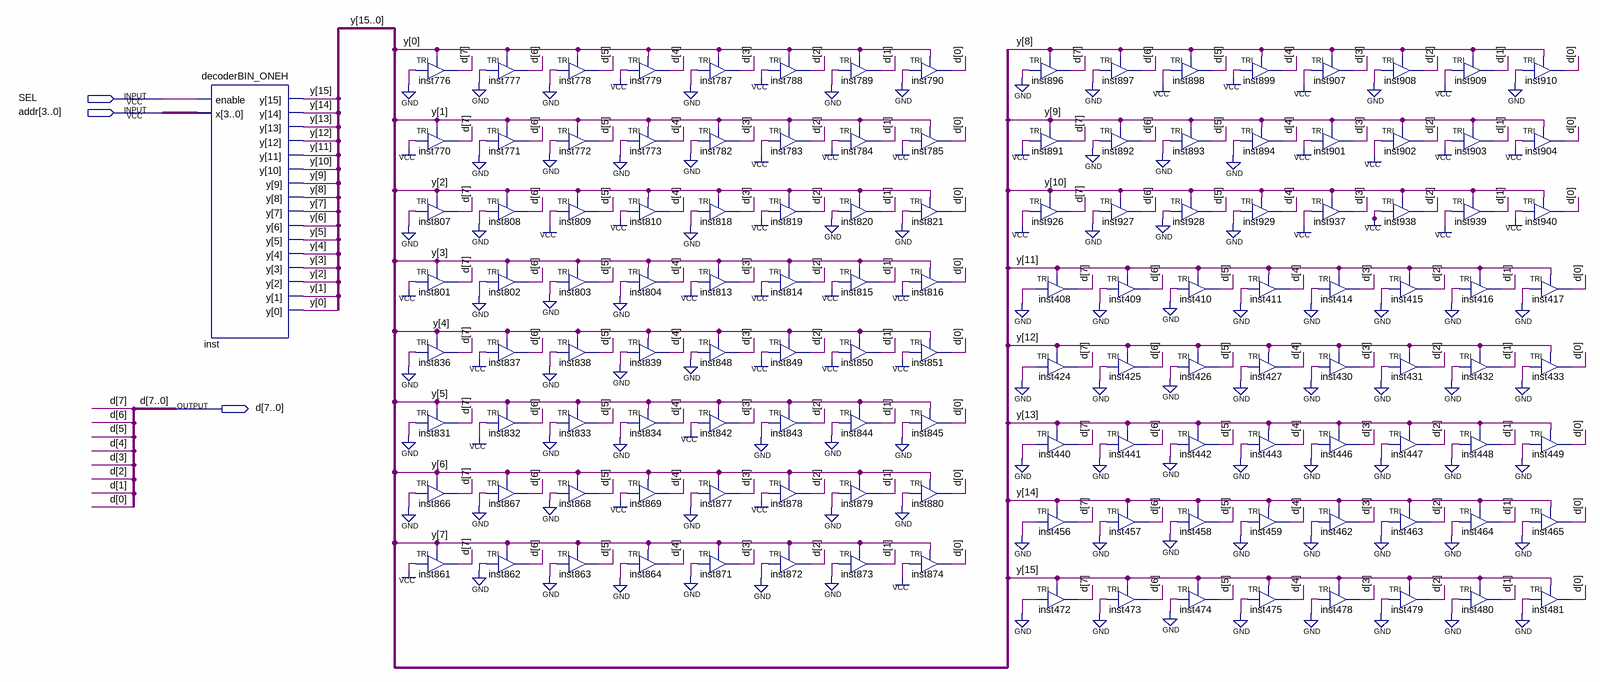
[diagram p0: schematic sheet]
// Quartus schematic rom16x8_23.bdf as structural Verilog: 129 symbols, 3 pins
module rom16x8_23 (
  input  SEL,
  input  [3:0] addr,
  output [7:0] d
);

  wire [15:0] y;

  decoderBIN_ONEH inst (.enable(SEL), .x(addr), .y(y));
  TRI inst776 (.IN(1'b0), .OE(y[0]), .OUT(d[7]));
  TRI inst770 (.IN(1'b1), .OE(y[1]), .OUT(d[7]));
  TRI inst807 (.IN(1'b0), .OE(y[2]), .OUT(d[7]));
  TRI inst801 (.IN(1'b1), .OE(y[3]), .OUT(d[7]));
  TRI inst836 (.IN(1'b0), .OE(y[4]), .OUT(d[7]));
  TRI inst831 (.IN(1'b0), .OE(y[5]), .OUT(d[7]));
  TRI inst866 (.IN(1'b0), .OE(y[6]), .OUT(d[7]));
  TRI inst861 (.IN(1'b1), .OE(y[7]), .OUT(d[7]));
  TRI inst777 (.IN(1'b0), .OE(y[0]), .OUT(d[6]));
  TRI inst771 (.IN(1'b0), .OE(y[1]), .OUT(d[6]));
  TRI inst808 (.IN(1'b0), .OE(y[2]), .OUT(d[6]));
  TRI inst802 (.IN(1'b0), .OE(y[3]), .OUT(d[6]));
  TRI inst837 (.IN(1'b1), .OE(y[4]), .OUT(d[6]));
  TRI inst832 (.IN(1'b1), .OE(y[5]), .OUT(d[6]));
  TRI inst867 (.IN(1'b0), .OE(y[6]), .OUT(d[6]));
  TRI inst862 (.IN(1'b0), .OE(y[7]), .OUT(d[6]));
  TRI inst778 (.IN(1'b0), .OE(y[0]), .OUT(d[5]));
  TRI inst772 (.IN(1'b0), .OE(y[1]), .OUT(d[5]));
  TRI inst809 (.IN(1'b1), .OE(y[2]), .OUT(d[5]));
  TRI inst803 (.IN(1'b0), .OE(y[3]), .OUT(d[5]));
  TRI inst838 (.IN(1'b0), .OE(y[4]), .OUT(d[5]));
  TRI inst833 (.IN(1'b0), .OE(y[5]), .OUT(d[5]));
  TRI inst868 (.IN(1'b0), .OE(y[6]), .OUT(d[5]));
  TRI inst863 (.IN(1'b0), .OE(y[7]), .OUT(d[5]));
  TRI inst779 (.IN(1'b1), .OE(y[0]), .OUT(d[4]));
  TRI inst773 (.IN(1'b0), .OE(y[1]), .OUT(d[4]));
  TRI inst810 (.IN(1'b1), .OE(y[2]), .OUT(d[4]));
  TRI inst804 (.IN(1'b0), .OE(y[3]), .OUT(d[4]));
  TRI inst839 (.IN(1'b0), .OE(y[4]), .OUT(d[4]));
  TRI inst834 (.IN(1'b0), .OE(y[5]), .OUT(d[4]));
  TRI inst869 (.IN(1'b1), .OE(y[6]), .OUT(d[4]));
  TRI inst864 (.IN(1'b0), .OE(y[7]), .OUT(d[4]));
  TRI inst787 (.IN(1'b0), .OE(y[0]), .OUT(d[3]));
  TRI inst782 (.IN(1'b0), .OE(y[1]), .OUT(d[3]));
  TRI inst818 (.IN(1'b0), .OE(y[2]), .OUT(d[3]));
  TRI inst813 (.IN(1'b1), .OE(y[3]), .OUT(d[3]));
  TRI inst848 (.IN(1'b0), .OE(y[4]), .OUT(d[3]));
  TRI inst842 (.IN(1'b1), .OE(y[5]), .OUT(d[3]));
  TRI inst877 (.IN(1'b0), .OE(y[6]), .OUT(d[3]));
  TRI inst871 (.IN(1'b0), .OE(y[7]), .OUT(d[3]));
  TRI inst788 (.IN(1'b1), .OE(y[0]), .OUT(d[2]));
  TRI inst783 (.IN(1'b1), .OE(y[1]), .OUT(d[2]));
  TRI inst819 (.IN(1'b1), .OE(y[2]), .OUT(d[2]));
  TRI inst814 (.IN(1'b1), .OE(y[3]), .OUT(d[2]));
  TRI inst849 (.IN(1'b1), .OE(y[4]), .OUT(d[2]));
  TRI inst843 (.IN(1'b0), .OE(y[5]), .OUT(d[2]));
  TRI inst878 (.IN(1'b1), .OE(y[6]), .OUT(d[2]));
  TRI inst872 (.IN(1'b0), .OE(y[7]), .OUT(d[2]));
  TRI inst789 (.IN(1'b0), .OE(y[0]), .OUT(d[1]));
  TRI inst784 (.IN(1'b1), .OE(y[1]), .OUT(d[1]));
  TRI inst820 (.IN(1'b0), .OE(y[2]), .OUT(d[1]));
  TRI inst815 (.IN(1'b1), .OE(y[3]), .OUT(d[1]));
  TRI inst850 (.IN(1'b1), .OE(y[4]), .OUT(d[1]));
  TRI inst844 (.IN(1'b0), .OE(y[5]), .OUT(d[1]));
  TRI inst879 (.IN(1'b0), .OE(y[6]), .OUT(d[1]));
  TRI inst873 (.IN(1'b0), .OE(y[7]), .OUT(d[1]));
  TRI inst790 (.IN(1'b0), .OE(y[0]), .OUT(d[0]));
  TRI inst785 (.IN(1'b1), .OE(y[1]), .OUT(d[0]));
  TRI inst821 (.IN(1'b0), .OE(y[2]), .OUT(d[0]));
  TRI inst816 (.IN(1'b1), .OE(y[3]), .OUT(d[0]));
  TRI inst851 (.IN(1'b1), .OE(y[4]), .OUT(d[0]));
  TRI inst845 (.IN(1'b0), .OE(y[5]), .OUT(d[0]));
  TRI inst880 (.IN(1'b0), .OE(y[6]), .OUT(d[0]));
  TRI inst874 (.IN(1'b1), .OE(y[7]), .OUT(d[0]));
  TRI inst896 (.IN(1'b0), .OE(y[8]), .OUT(d[7]));
  TRI inst891 (.IN(1'b1), .OE(y[9]), .OUT(d[7]));
  TRI inst926 (.IN(1'b1), .OE(y[10]), .OUT(d[7]));
  TRI inst408 (.IN(1'b0), .OE(y[11]), .OUT(d[7]));
  TRI inst424 (.IN(1'b0), .OE(y[12]), .OUT(d[7]));
  TRI inst440 (.IN(1'b0), .OE(y[13]), .OUT(d[7]));
  TRI inst456 (.IN(1'b0), .OE(y[14]), .OUT(d[7]));
  TRI inst472 (.IN(1'b0), .OE(y[15]), .OUT(d[7]));
  TRI inst897 (.IN(1'b0), .OE(y[8]), .OUT(d[6]));
  TRI inst892 (.IN(1'b0), .OE(y[9]), .OUT(d[6]));
  TRI inst927 (.IN(1'b0), .OE(y[10]), .OUT(d[6]));
  TRI inst409 (.IN(1'b0), .OE(y[11]), .OUT(d[6]));
  TRI inst425 (.IN(1'b0), .OE(y[12]), .OUT(d[6]));
  TRI inst441 (.IN(1'b0), .OE(y[13]), .OUT(d[6]));
  TRI inst457 (.IN(1'b0), .OE(y[14]), .OUT(d[6]));
  TRI inst473 (.IN(1'b0), .OE(y[15]), .OUT(d[6]));
  TRI inst898 (.IN(1'b1), .OE(y[8]), .OUT(d[5]));
  TRI inst893 (.IN(1'b0), .OE(y[9]), .OUT(d[5]));
  TRI inst928 (.IN(1'b0), .OE(y[10]), .OUT(d[5]));
  TRI inst410 (.IN(1'b0), .OE(y[11]), .OUT(d[5]));
  TRI inst426 (.IN(1'b0), .OE(y[12]), .OUT(d[5]));
  TRI inst442 (.IN(1'b0), .OE(y[13]), .OUT(d[5]));
  TRI inst458 (.IN(1'b0), .OE(y[14]), .OUT(d[5]));
  TRI inst474 (.IN(1'b0), .OE(y[15]), .OUT(d[5]));
  TRI inst899 (.IN(1'b1), .OE(y[8]), .OUT(d[4]));
  TRI inst894 (.IN(1'b0), .OE(y[9]), .OUT(d[4]));
  TRI inst929 (.IN(1'b0), .OE(y[10]), .OUT(d[4]));
  TRI inst411 (.IN(1'b0), .OE(y[11]), .OUT(d[4]));
  TRI inst427 (.IN(1'b0), .OE(y[12]), .OUT(d[4]));
  TRI inst443 (.IN(1'b0), .OE(y[13]), .OUT(d[4]));
  TRI inst459 (.IN(1'b0), .OE(y[14]), .OUT(d[4]));
  TRI inst475 (.IN(1'b0), .OE(y[15]), .OUT(d[4]));
  TRI inst907 (.IN(1'b1), .OE(y[8]), .OUT(d[3]));
  TRI inst901 (.IN(1'b1), .OE(y[9]), .OUT(d[3]));
  TRI inst937 (.IN(1'b1), .OE(y[10]), .OUT(d[3]));
  TRI inst414 (.IN(1'b0), .OE(y[11]), .OUT(d[3]));
  TRI inst430 (.IN(1'b0), .OE(y[12]), .OUT(d[3]));
  TRI inst446 (.IN(1'b0), .OE(y[13]), .OUT(d[3]));
  TRI inst462 (.IN(1'b0), .OE(y[14]), .OUT(d[3]));
  TRI inst478 (.IN(1'b0), .OE(y[15]), .OUT(d[3]));
  TRI inst908 (.IN(1'b0), .OE(y[8]), .OUT(d[2]));
  TRI inst902 (.IN(1'b1), .OE(y[9]), .OUT(d[2]));
  TRI inst938 (.IN(1'b1), .OE(y[10]), .OUT(d[2]));
  TRI inst415 (.IN(1'b0), .OE(y[11]), .OUT(d[2]));
  TRI inst431 (.IN(1'b0), .OE(y[12]), .OUT(d[2]));
  TRI inst447 (.IN(1'b0), .OE(y[13]), .OUT(d[2]));
  TRI inst463 (.IN(1'b0), .OE(y[14]), .OUT(d[2]));
  TRI inst479 (.IN(1'b0), .OE(y[15]), .OUT(d[2]));
  TRI inst909 (.IN(1'b1), .OE(y[8]), .OUT(d[1]));
  TRI inst903 (.IN(1'b1), .OE(y[9]), .OUT(d[1]));
  TRI inst939 (.IN(1'b1), .OE(y[10]), .OUT(d[1]));
  TRI inst416 (.IN(1'b0), .OE(y[11]), .OUT(d[1]));
  TRI inst432 (.IN(1'b0), .OE(y[12]), .OUT(d[1]));
  TRI inst448 (.IN(1'b0), .OE(y[13]), .OUT(d[1]));
  TRI inst464 (.IN(1'b0), .OE(y[14]), .OUT(d[1]));
  TRI inst480 (.IN(1'b0), .OE(y[15]), .OUT(d[1]));
  TRI inst910 (.IN(1'b0), .OE(y[8]), .OUT(d[0]));
  TRI inst904 (.IN(1'b1), .OE(y[9]), .OUT(d[0]));
  TRI inst940 (.IN(1'b1), .OE(y[10]), .OUT(d[0]));
  TRI inst417 (.IN(1'b0), .OE(y[11]), .OUT(d[0]));
  TRI inst433 (.IN(1'b0), .OE(y[12]), .OUT(d[0]));
  TRI inst449 (.IN(1'b0), .OE(y[13]), .OUT(d[0]));
  TRI inst465 (.IN(1'b0), .OE(y[14]), .OUT(d[0]));
  TRI inst481 (.IN(1'b0), .OE(y[15]), .OUT(d[0]));
endmodule
